# EAGLE design 12V-input-filter (EAGLE 8.3.1)
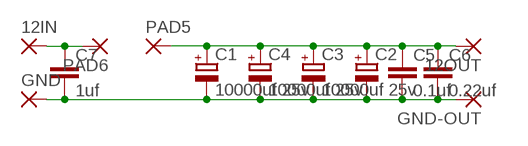
[diagram p0: schematic, sheet 1]

## Parts
12IN  3,81/1,4  [3,81/1,4]
12OUT  3,81/1,4  [3,81/1,4]
C1  10000uf 25v  CPOL-EUE10-22.5  [EB22,5D]
C2  CPOL-EUE10-22.5  [EB22,5D]
C3  10000uf 25v  CPOL-EUE10-22.5  [EB22,5D]
C4  10000uf 25v  CPOL-EUE10-22.5  [EB22,5D]
C5  0.1uf  C-EU150-064X183  [C150-064X183]
C6  0.22uf  C-EU150-064X183  [C150-064X183]
C7  1uf  C-EU150-064X183  [C150-064X183]
GND  3,81/1,4  [3,81/1,4]
GND-OUT  3,81/1,4  [3,81/1,4]
PAD5  3,81/1,4  [3,81/1,4]
PAD6  3,81/1,4  [3,81/1,4]

## Nets
N$1: C1.- C2.- C3.- C4.- C5.2 C6.2 C7.2 GND-OUT.1(P) GND.1(P)
N$2: 12OUT.1(P) C1.+ C2.+ C3.+ C4.+ C5.1 C6.1 PAD5.1(P)
N$3: 12IN.1(P) C7.1 PAD6.1(P)

## Library data of the parts
12IN 12OUT GND GND-OUT PAD5 PAD6 = wirepad:3,81/1,4: THROUGH-HOLE PAD
C1-C4 = resistor:CPOL-EU: POLARIZED CAPACITOR, European symbol
C5-C7 = resistor:C-EU: CAPACITOR, European symbol

## Board
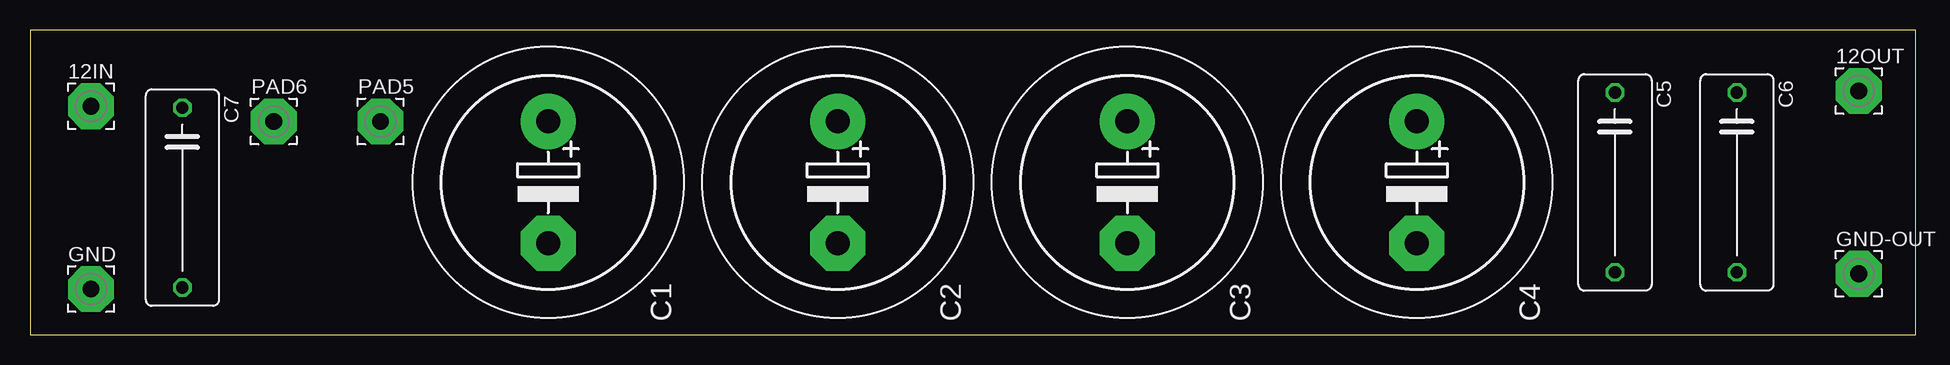
[diagram p1: board, top side]
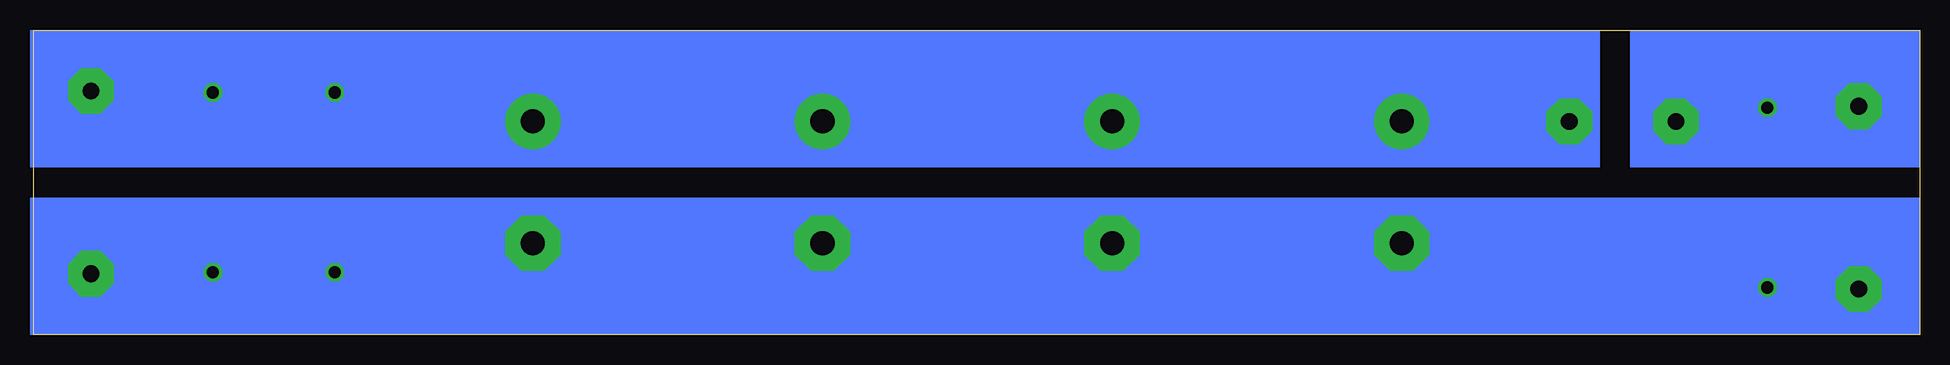
[diagram p2: board, bottom side, seen from below]

Size 157.15 x 25.39 mm. Coordinates in mm from the lower left corner, seen from the top.
Outline: 0,0 157.15,0 157.15,25.39 0,25.39 0,0
Copper layers (1*16): Top 0.035mm / dielectric 1.5mm / Bottom 0.035mm
Design rules "default *": minimum track width 1mm, minimum drill 0.35mm, track to track 6mil, track to pad 6mil, pad to pad 6mil, via to via 6mil, smd to smd 6mil, copper to edge 40mil, drill to drill 6mil, minimum pad ring 10mil, minimum via ring 8mil, stop-mask expansion 4mil, vias tented up to drill 0mil, thermal gap 10mil

### Footprints (pad centres in the part's own frame; a part is rotated, then mirrored left to right if it is on the bottom)
3,81/1,4 = drill 1.397 pad 3.81 octagon: 1 0,0
EB22,5D = drill 2.007 pad 4.597: + -5.08,0 | drill 2.007 pad 4.597 octagon: - 5.08,0
C150-064X183 = drill 1.016 octagon: 1 -7.493,0; 2 7.493,0

### Placement (x,y rotation side)
12IN  5.08,19.05 0 top
12OUT  152.4,20.32 0 top
C1  43.18,12.7 270 top
C2  67.31,12.7 270 top
C3  91.44,12.7 270 top
C4  115.57,12.7 270 top
C5  132.08,12.7 270 top
C6  142.24,12.7 270 top
C7  12.7,11.43 270 top
GND  5.08,3.81 0 top
GND-OUT  152.4,5.08 0 top
PAD5  29.21,17.78 0 top
PAD6  20.32,17.78 0 top

### Tracks (layer width: path | path; a pad name or v marks a point on that pad's centre or on a via)
N$1
  Bottom 1: GND-OUT.1 152.12,5.48 142.32,5.48 C6.2 141.75,5.48 132.53,5.48 C5.2 131.95,5.48 130.22,7.21 115.82,7.21 C4.- 115.24,7.78 91.62,7.78 C3.- 91.04,7.78 67.42,7.78 C2.- 66.84,7.78 43.22,7.78 C1.- 42.64,7.21 39.76,4.33 13.25,4.33 C7.2 12.68,3.75 5.19,3.75 GND.1
N$2
  Bottom 1: 12OUT.1 152.12,20.46 142.32,20.46 C6.1 141.75,20.46 132.53,20.46 C5.1 131.95,19.89 130.22,18.16 115.82,18.16 C4.+ 115.24,18.16 91.62,18.16 C3.+ 91.04,18.16 67.42,18.16 C2.+ 66.84,18.16 43.22,18.16 C1.+ 42.64,17.58 29.39,17.58 PAD5.1
N$3
  Bottom 1: 12IN.1 5.19,18.73 12.68,18.73 C7.1 13.25,18.73 13.83,18.16 20.17,18.16 PAD6.1
(copper drawn outside any net)
  shapes: Bottom area x3